# Altium project 点屏盒子.PrjPcb
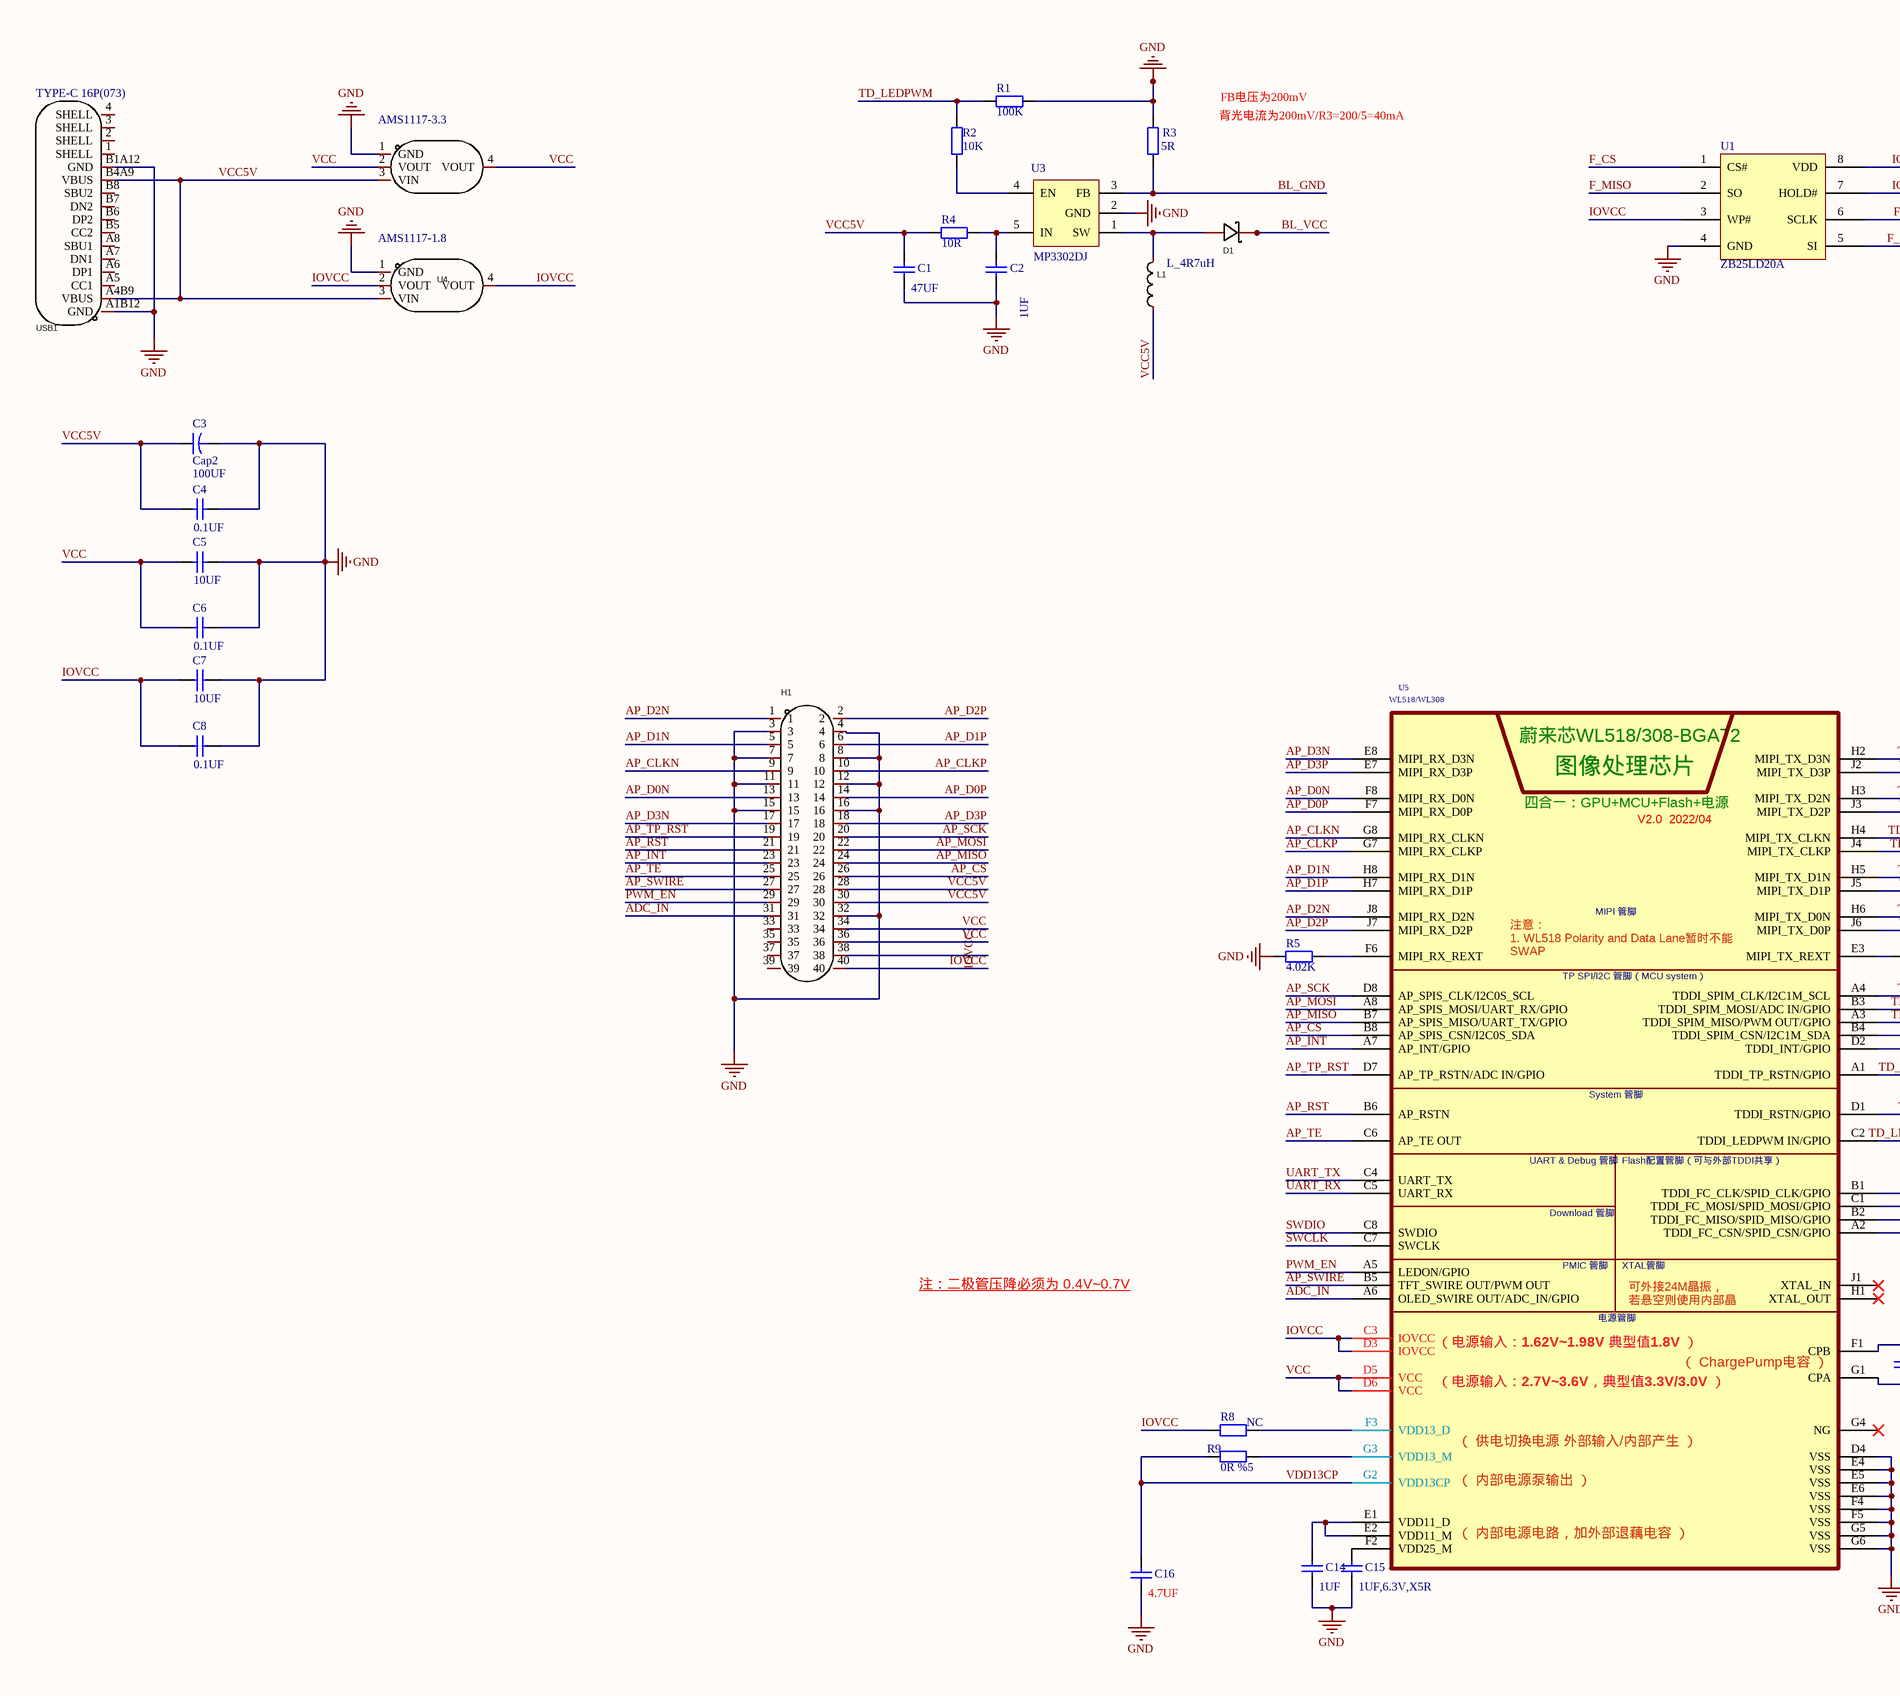
[diagram p0: Sheet1.SchDoc, left]
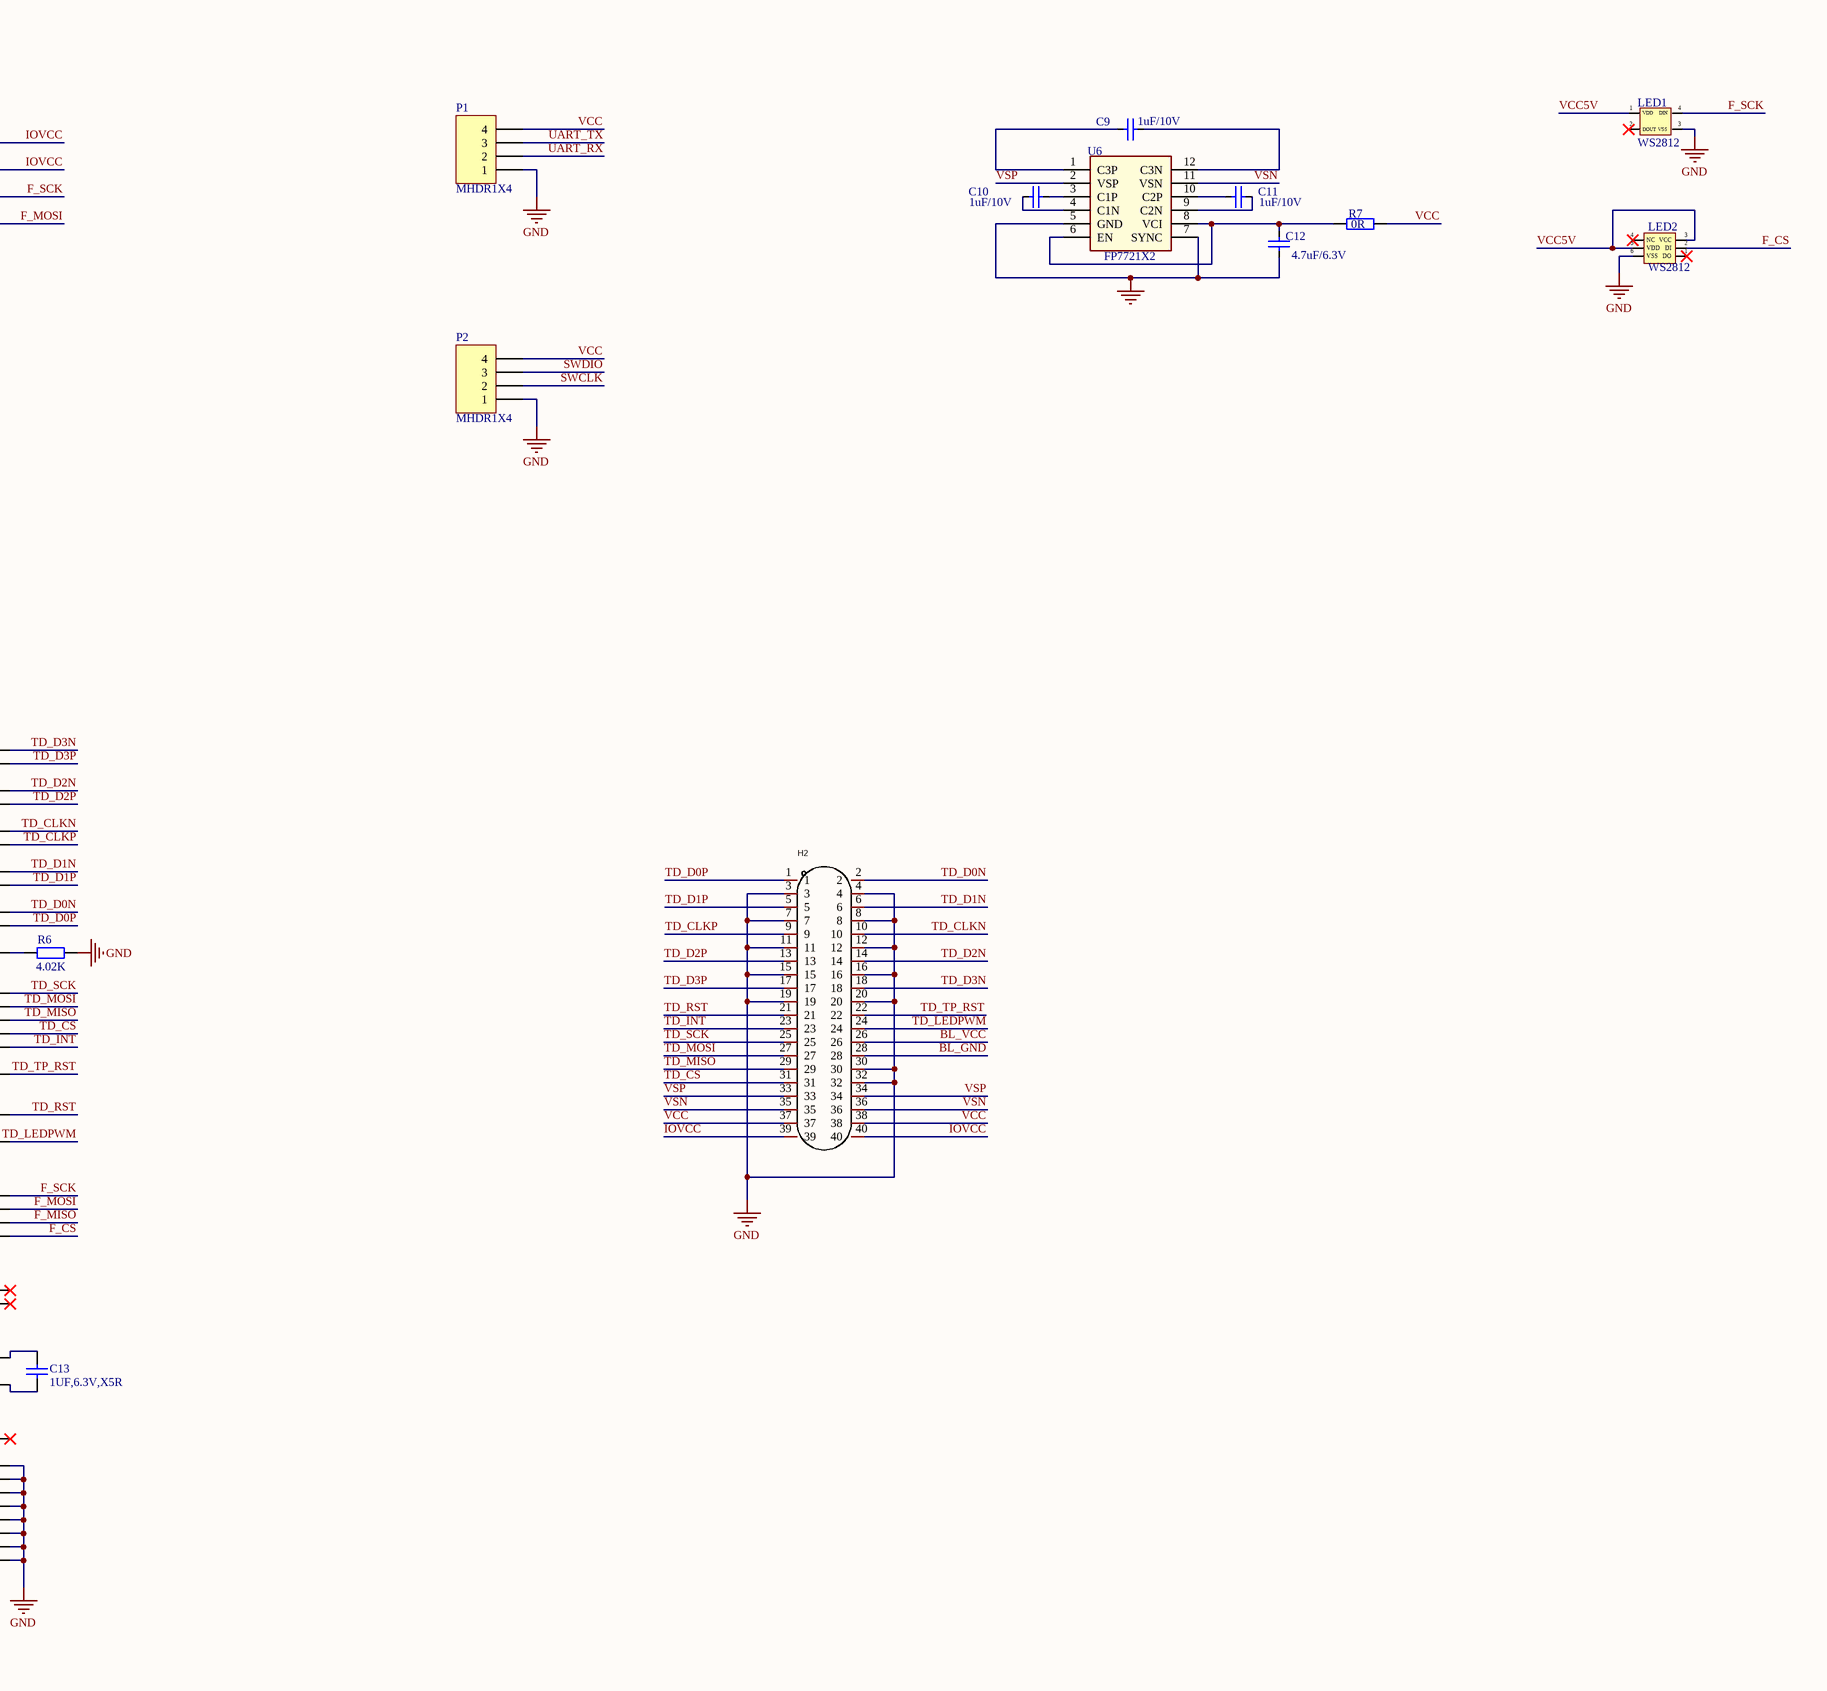
[diagram p1: Sheet1.SchDoc, right]
1 sheet, 40 parts. Net scope: global (net labels, ports and power ports of the same name join across sheets).
Board file: PCB1.PcbDoc

## Sheet Sheet1.SchDoc
size A1; SheetNumber: 1; SheetTotal: 1; SPICEModelCacheLBNAHHPP: <root> / <DocumentId>LBNAHHPP</DocumentId> / <CacheFrame Number="0"> / <Model Name="cap" Kind="MDL"> / <Text>*Default semiconductor capacitor / .MODEL CAP C()</Text> / </Model> / </CacheFrame> / </root>

### Parts
C1  47UF  [C0603]
C2  1UF  [C0603]
C3  Cap2  value 100UF  [CAPR5-4X5]
C4  0.1UF  [C0603]
C5  10UF  [C0603]
C6  0.1UF  [C0603]
C7  10UF  [C0603]
C8  0.1UF  [C0603]
C9  1uF/10V  [C0603]
C10  1uF/10V  [C0603]
C11  1uF/10V  [C0603]
C12  4.7uF/6.3V  [C0603]
C13  1UF,6.3V,X5R  [C0603]
C14  1UF  [C0603]
C15  1UF,6.3V,X5R  [C0603]
C16  4.7UF  [C0603]
D1  1N5819HW-7-F  [SOD-123_L2.8-W1.8-LS3.7-FD]  (value not drawn)
H1  PZ200-2-20-Z  [HDR-TH_40P-P2.00-V-M-R2-C20-S2.00]  (value not drawn)
H2  PZ200-2-20-Z  [HDR-TH_40P-P2.00-V-M-R2-C20-S2.00]  (value not drawn)
L1  L_4R7uH  [IND-SMD_L5.2-W5.1]
LED1  WS2812  [WS2812_LED_4]
LED2  WS2812  [WS2812_LED_6]
P1  MHDR1X4  [MHDR1X4]
P2  MHDR1X4  [MHDR1X4]
R1  value 100K  [R0603]  (hidden comment: Res2)
R2  value 10K  [R0603]  (hidden comment: Res2)
R3  value 5R  [R0603]  (hidden comment: Res2)
R4  value 10R  [R0603]  (hidden comment: Res2)
R5  value 4.02K  [R0603]  (hidden comment: Res2)
R6  value 4.02K  [R0603]  (hidden comment: Res2)
R7  0R  [R0603]
R8  value NC  [R0603]  (hidden comment: Res2)
R9  value 0R %5  [R0603]  (hidden comment: Res2)
U1  ZB25LD20A  [FLASH-WSON-8- 2X3mm]
U2  AMS1117-3.3  [SOT-223-3_L6.5-W3.4-P2.30-LS7.0-BR]
U3  MP3302DJ  [TSOT-23-5_L2.9-W1.6-P0.95-LS2.8-BR]
U4  AMS1117-1.8  [SOT-223-3_L6.5-W3.4-P2.30-LS7.0-BR]
U5  WL518/WL308  [WL518-BGA72 4.5mm*5mm]
U6  FP7721X2  [FP7721X2]
USB1  TYPE-C 16P(073)  [USB-C-SMD_TYPE-C16PIN_C668624]

### Nets
GND: C1.2 C2.2 C3.2 C4.2 C5.2 C6.2 C7.2 C8.2 C12.2 C14.2 C15.2 C16.2 H1.3 H1.4 H1.7 H1.8 H1.11 H1.12 H1.15 H1.16 H1.32 H2.3 H2.4 H2.7 H2.8 H2.11 H2.12 H2.15 H2.16 H2.19 H2.20 H2.30 H2.32 LED1.3(VSS) LED2.6(VSS) P1.1 P2.1 R1.1 R3.1 R5.2 R6.2 U1.4(GND) U2.1(GND) U3.2(GND) U4.1(GND) U5.D4(VSS) U5.E4(VSS) U5.E5(VSS) U5.E6(VSS) U5.F4(VSS) U5.F5(VSS) U5.G5(VSS) U5.G6(VSS) U6.5(GND) U6.7(SYNC) USB1.A1B12(GND) USB1.B1A12(GND)
ADC_IN: H1.31 U5.A6(OLED_SWIRE_OUT/ADC_IN/GPIO)
AP_CLKN: H1.9 U5.G8(MIPI_RX_CLKN)
AP_CLKP: H1.10 U5.G7(MIPI_RX_CLKP)
AP_CS: H1.26 U5.B8(AP_SPIS_CSN/I2C0S_SDA)
AP_D0N: H1.13 U5.F8(MIPI_RX_D0N)
AP_D0P: H1.14 U5.F7(MIPI_RX_D0P)
AP_D1N: H1.5 U5.H8(MIPI_RX_D1N)
AP_D1P: H1.6 U5.H7(MIPI_RX_D1P)
AP_D2N: H1.1 U5.J8(MIPI_RX_D2N)
AP_D2P: H1.2 U5.J7(MIPI_RX_D2P)
AP_D3N: H1.17 U5.E8(MIPI_RX_D3N)
AP_D3P: H1.18 U5.E7(MIPI_RX_D3P)
AP_INT: H1.23 U5.A7(AP_INT/GPIO)
AP_MISO: H1.24 U5.B7(AP_SPIS_MISO/UART_TX/GPIO)
AP_MOSI: H1.22 U5.A8(AP_SPIS_MOSI/UART_RX/GPIO)
AP_RST: H1.21 U5.B6(AP_RSTN)
AP_SCK: H1.20 U5.D8(AP_SPIS_CLK/I2C0S_SCL)
AP_SWIRE: H1.27 U5.B5(TFT_SWIRE_OUT/PWM_OUT)
AP_TE: H1.25 U5.C6(AP_TE_OUT)
AP_TP_RST: H1.19 U5.D7(AP_TP_RSTN/ADC_IN/GPIO)
BL_GND: H2.28 R3.2 U3.3(FB)
BL_VCC: D1.2(K) H2.26
F_CS: LED2.2(DI) U1.1(CS#) U5.A2(TDDI_FC_CSN/SPID_CSN/GPIO)
F_MISO: U1.2(SO) U5.B2(TDDI_FC_MISO/SPID_MISO/GPIO)
F_MOSI: U1.5(SI) U5.C1(TDDI_FC_MOSI/SPID_MOSI/GPIO)
F_SCK: LED1.4(DIN) U1.6(SCLK) U5.B1(TDDI_FC_CLK/SPID_CLK/GPIO)
IOVCC: C7.1 C8.1 H1.40 H2.39 H2.40 R8.2 U1.3(WP#) U1.7(HOLD#) U1.8(VDD) U4.2(VOUT) U4.4(VOUT) U5.C3(IOVCC) U5.D3(IOVCC)
PWM_EN: H1.29 U5.A5(LEDON/GPIO)
SWCLK: P2.2 U5.C7(SWCLK)
SWDIO: P2.3 U5.C8(SWDIO)
TD_CLKN: H2.10 U5.H4(MIPI_TX_CLKN)
TD_CLKP: H2.9 U5.J4(MIPI_TX_CLKP)
TD_CS: H2.31 U5.B4(TDDI_SPIM_CSN/I2C1M_SDA)
TD_D0N: H2.2 U5.H6(MIPI_TX_D0N)
TD_D0P: H2.1 U5.J6(MIPI_TX_D0P)
TD_D1N: H2.6 U5.H5(MIPI_TX_D1N)
TD_D1P: H2.5 U5.J5(MIPI_TX_D1P)
TD_D2N: H2.14 U5.H3(MIPI_TX_D2N)
TD_D2P: H2.13 U5.J3(MIPI_TX_D2P)
TD_D3N: H2.18 U5.H2(MIPI_TX_D3N)
TD_D3P: H2.17 U5.J2(MIPI_TX_D3P)
TD_INT: H2.23 U5.D2(TDDI_INT/GPIO)
TD_LEDPWM: H2.24 R1.2 R2.2 U5.C2(TDDI_LEDPWM_IN/GPIO)
TD_MISO: H2.29 U5.A3(TDDI_SPIM_MISO/PWM_OUT/GPIO)
TD_MOSI: H2.27 U5.B3(TDDI_SPIM_MOSI/ADC_IN/GPIO)
TD_RST: H2.21 U5.D1(TDDI_RSTN/GPIO)
TD_SCK: H2.25 U5.A4(TDDI_SPIM_CLK/I2C1M_SCL)
TD_TP_RST: H2.22 U5.A1(TDDI_TP_RSTN/GPIO)
UART_RX: P1.2 U5.C5(UART_RX)
UART_TX: P1.3 U5.C4(UART_TX)
VCC: C5.1 C6.1 H1.34 H1.36 H2.37 H2.38 P1.4 P2.4 R7.2 U2.2(VOUT) U2.4(VOUT) U5.D5(VCC) U5.D6(VCC)
VCC5V: C1.1 C3.1 C4.1 H1.28 H1.30 L1.1 LED1.1(VDD) LED2.3(VCC) LED2.5(VDD) R4.2 U2.3(VIN) U4.3(VIN) USB1.A4B9(VBUS) USB1.B4A9(VBUS)
VDD13CP: C16.1 R9.2 U5.G2(VDD13CP)
VSN: H2.35 H2.36 U6.11(VSN)
VSP: H2.33 H2.34 U6.2(VSP)
NetC2_1: C2.1 R4.1 U3.5(IN)
NetC9_1: C9.1 U6.12(C3N)
NetC9_2: C9.2 U6.1(C3P)
NetC10_1: C10.1 U6.3(C1P)
NetC10_2: C10.2 U6.4(C1N)
NetC11_1: C11.1 U6.9(C2N)
NetC11_2: C11.2 U6.10(C2P)
NetC12_1: C12.1 R7.1 U6.6(EN) U6.8(VCI)
NetC13_1: C13.1 U5.G1(CPA)
NetC13_2: C13.2 U5.F1(CPB)
NetC14_1: C14.1 U5.E1(VDD11_D) U5.E2(VDD11_M)
NetC15_1: C15.1 U5.F2(VDD25_M)
NetD1_1: D1.1(A) L1.2 U3.1(SW)
NetR2_1: R2.1 U3.4(EN)
NetR5_1: R5.1 U5.F6(MIPI_RX_REXT)
NetR6_1: R6.1 U5.E3(MIPI_TX_REXT)
NetR8_1: R8.1 U5.F3(VDD13_D)
NetR9_1: R9.1 U5.G3(VDD13_M)

Not connected (* = marked no-connect by the designer): H1 33 35 37 38 39; LED1 2(DOUT)*; LED2 1(DO)* 4(NC)*; U5 G4(NG)* H1(XTAL_OUT)* J1(XTAL_IN)*; USB1 1(SHELL) 2(SHELL) 3(SHELL) 4(SHELL) A5(CC1) A6(DP1) A7(DN1) A8(SBU1) B5(CC2) B6(DP2) B7(DN2) B8(SBU2)

### Notes on the sheet
- FB电压为200mV
- 背光电流为200mV/R3=200/5=40mA
- 注：二极管压降必须为 0.4V~0.7V
- Labels drawn without touching a wire or pin: IOVCC
- (in symbol BGA72 4.5mm*5mm) 蔚来芯WL518/308-BGA72; 图像处理芯片; 四合一：GPU+MCU+Flash+电源; V2.0  2022/04; MIPI 管脚; 注意： / 1. WL518 Polarity and Data Lane暂时不能SWAP / 2. MIPI阻抗匹配电阻为4.02KΩ, E96精度; TP SPI/I2C 管脚（MCU system）; System 管脚; UART & Debug 管脚; Flash配置管脚（可与外部TDDI共享）; Download 管脚; PMIC 管脚; XTAL管脚; 可外接24M晶振， / 若悬空则使用内部晶振; 电源管脚; （电源输入：1.62V~1.98V 典型值1.8V ）; （ ChargePump电容 ）; （电源输入：2.7V~3.6V，典型值3.3V/3.0V ）; （ 供电切换电源 外部输入/内部产生 ）; （ 内部电源泵输出 ）; （ 内部电源电路，加外部退藕电容 ）

### Library data of the parts
C1 C2 C4-C8 C13-C16 = Cap: Capacitor; Published: 8-Jun-2000; LatestRevisionDate: 17-Jul-2002; LatestRevisionNote: Re-released for DXP Platform.; PackageReference: RAD-0.3; Publisher: Altium Limited; PackageDescription: Radial Cap, Thru-Hole; 2 Leads; 0.3 in Pin Spacing
C3 = Cap2: Capacitor; Published: 23-Sep-2002; PackageReference: CAPR5-4X5; Publisher: Altium Limited; PackageDescription: Capacitor; 2 Leads
C9-C12 = Cap: Capacitor; Parameter: 10V，X7R, ±10%
D1 = 1N5819HW-7-F: Manufacturer: DIODES(美台); Add into BOM: yes; Reverse Voltage (Vr): 40V; Average Rectified Current (Io): 1A; Forward Voltage (Vf@If): 450mV@1A; Name: 1N5819HW-7-F; Symbol: 1N5819HW-7-F; Device: 1N5819HW-7-F; LCSC Part Name: 40V 1A 450mV@1A; Supplier Part: C82544; Manufacturer Part: 1N5819HW-7-F; Supplier Footprint: SOD-123; JLCPCB Part Class: Extended Part; Datasheet: https://atta.szlcsc.com/upload/public/pdf/source/20161024/1477288459223.pdf; Supplier: LCSC; Convert to PCB: yes
H1 H2 = 排针2X20P: Manufacturer: HCTL(华灿天禄); Add into BOM: yes; Pitch: 2mm; Pin Structure: 2x20P; Circluar Pins/Square Pins: 方针; Current Rating (Max): 1.5A; Name: PZ200-2-20-Z; Symbol: PZ200-2-20-Z; Device: PZ200-2-20-Z; LCSC Part Name: 2mm 2x20P 直插 方针; Supplier Part: C2906006; Manufacturer Part: PZ200-2-20-Z; Supplier Footprint: 插件,P=2mm; JLCPCB Part Class: Extended Part; Datasheet: https://atta.szlcsc.com/upload/public/pdf/source/20211108/81EC9D0128C817B17F97D545889289A1.pdf; Supplier: LCSC; Convert to PCB: yes; Number of Pins: 40; Number of Rows: 2; Row Spacing: 2mm; Mounting Type: 直插; Voltage Rating (Max): -; Length of Mating Pin: 3.9mm; Insulation Height: 2mm; Length of End Connection Pin: 2.8mm; Operating Temperature Range: -40℃~+105℃; Color: 黑色
L1 = SPM5030T-4R7M-HZ: 4R7uH电感 SMD封装 SPM5030T-4R7M-HZ; Manufacturer: TDK; Name: 4.7uH; Add into BOM: yes; Value: 4.7uH; Tolerance: ±20%; Rated Current: 4A; DC Resistance (DCR): 45mΩ; Symbol: SPM5030T-4R7M-HZ; Device: SPM5030T-4R7M-HZ; LCSC Part Name: 4.7uH ±20% 4A 45mΩ; Supplier Part: C435271; Manufacturer Part: SPM5030T-4R7M-HZ; Supplier Footprint: SMD; JLCPCB Part Class: Extended Part; Datasheet: https://atta.szlcsc.com/upload/public/pdf/source/20191009/C435271_9A6F67BD8321F0FE2BD27E7481E0EA5D.pdf; Supplier: LCSC; Convert to PCB: yes
LED1 = WS2812_LED_4: WS2812 LED 4P
LED2 = WS2812_LED_6: WS2812 LED 6P
P1 P2 = MHDR1X4: Header, 4-Pin; LatestRevisionDate: 17-Jul-2002; LatestRevisionNote: Re-released for DXP Platform.; Publisher: Altium Limited
R1-R6 R8 R9 = Res2: Resistor; Published: 8-Jun-2000; LatestRevisionDate: 17-Jul-2002; LatestRevisionNote: Re-released for DXP Platform.; PackageReference: AXIAL-0.4; Publisher: Altium Limited; PackageDescription: Axial Device, Thru-Hole; 2 Leads; 0.4 in Pin Spacing
R7 = Res_5%: Resistor; Parameter: ±5%
U1 = ZB25LD20A: FLASH; Parameter: WSON-8- 2X3mm
U2 U4 = AMS1117-3.3_C6186: Manufacturer: 美国AMS; Add into BOM: yes; Output Type: 固定; Output Polarity: 正; Number of Outputs: 1; Output Voltage: 3.3V; Dropout Voltage: 1.3V@(800mA); Output Current: 1A; Power Supply Rejection Ratio (PSRR): 72dB@(120Hz); Name: AMS1117-3.3; Symbol: AMS1117-3.3; Device: AMS1117-3.3_C6186; LCSC Part Name: Vout=3.3V 1A 72dB@(120Hz); Supplier Part: C6186; Manufacturer Part: AMS1117-3.3; Supplier Footprint: SOT-223; JLCPCB Part Class: Basic Part; Datasheet: https://atta.szlcsc.com/upload/public/pdf/source/20180727/C6186_7A095716F0823C02F1997A905E26C086.pdf; Supplier: LCSC; Convert to PCB: yes; Maximum Input Voltage: -; Quiescent Current (Ground Current): -; Noise: -; Feature: -; Operating Temperature: -
U3 = MP3302DJ: 5V-24V电平转换芯片; Add into BOM: yes; Name: MP3302DJ; Symbol: MP3302DJ; Device: MP3302DJ; Convert to PCB: yes; PCB DECAL: TSOT-23-5_L2.9-W1.6-P0.95-LS2.8-BR
U5 = BGA72 4.5mm*5mm
USB1 = TYPE-C 16P(073): Manufacturer: SHOU HAN(首韩); Add into BOM: yes; Gender: 母座; Number of Contacts: 16; Number of Ports: 1; Mounting Sytle: 卧贴; Current Rating - Power (Max): 5A; Name: TYPE-C 16P(073); Symbol: TYPE-C 16P(073); Device: TYPE-C 16P(073); LCSC Part Name: TYPE-C母座 16P 4脚插件带定位柱 不锈钢外壳 3次模顶; Supplier Part: C668624; Manufacturer Part: TYPE-C 16P(073); Supplier Footprint: SMD; JLCPCB Part Class: Extended Part; Datasheet: https://atta.szlcsc.com/upload/public/pdf/source/20200618/C668624_CC51EC37614090AAD56C1421DE954C80.pdf; Supplier: LCSC; Convert to PCB: yes; Connector Type: Type-C; Standard: -; Operating Temperature Range: -25℃~+85℃